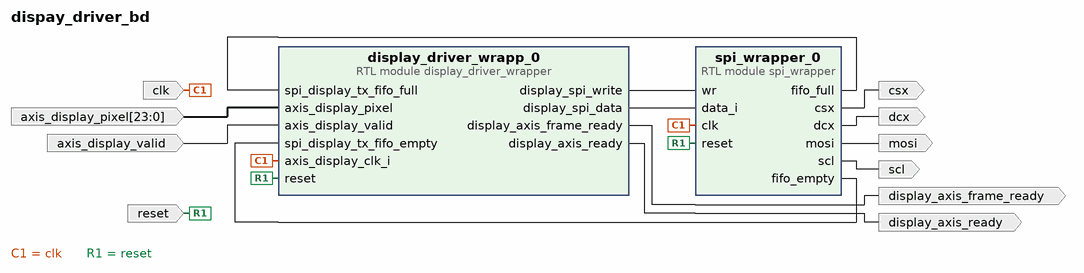
[diagram p0: block diagram of the top level]
# Vivado block design dispay_driver_bd, xc7z010clg400-1, Vivado 2020.1
create_bd_design dispay_driver_bd

create_bd_port -dir I -type clk clk
set_property -dict {CONFIG.FREQ_HZ 100000000} [get_bd_ports clk]
create_bd_port -dir O mosi
create_bd_port -dir O scl
create_bd_port -dir O csx
create_bd_port -dir O dcx
create_bd_port -dir I -type rst reset
create_bd_port -dir I -from 23 -to 0 axis_display_pixel
create_bd_port -dir I axis_display_valid
create_bd_port -dir O display_axis_ready
create_bd_port -dir O display_axis_frame_ready

create_bd_cell -type module -reference spi_wrapper spi_wrapper_0
create_bd_cell -type module -reference display_driver_wrapper display_driver_wrapp_0

# ---- connections ----

connect_bd_net [get_bd_pins display_driver_wrapp_0/display_spi_write] [get_bd_pins spi_wrapper_0/wr]
connect_bd_net [get_bd_pins display_driver_wrapp_0/display_spi_data] [get_bd_pins spi_wrapper_0/data_i]
connect_bd_net [get_bd_pins spi_wrapper_0/fifo_full] [get_bd_pins display_driver_wrapp_0/spi_display_tx_fifo_full]
connect_bd_net [get_bd_pins spi_wrapper_0/fifo_empty] [get_bd_pins display_driver_wrapp_0/spi_display_tx_fifo_empty]
connect_bd_net [get_bd_ports clk] [get_bd_pins spi_wrapper_0/clk] [get_bd_pins display_driver_wrapp_0/axis_display_clk_i]
connect_bd_net [get_bd_pins spi_wrapper_0/mosi] [get_bd_ports mosi]
connect_bd_net [get_bd_pins spi_wrapper_0/scl] [get_bd_ports scl]
connect_bd_net [get_bd_pins spi_wrapper_0/csx] [get_bd_ports csx]
connect_bd_net [get_bd_pins spi_wrapper_0/dcx] [get_bd_ports dcx]
connect_bd_net -net reset_0_1 [get_bd_ports reset] [get_bd_pins spi_wrapper_0/reset] [get_bd_pins display_driver_wrapp_0/reset]
connect_bd_net -net axis_display_pixel_0_1 [get_bd_ports axis_display_pixel] [get_bd_pins display_driver_wrapp_0/axis_display_pixel]
connect_bd_net -net axis_display_valid_0_1 [get_bd_ports axis_display_valid] [get_bd_pins display_driver_wrapp_0/axis_display_valid]
connect_bd_net [get_bd_pins display_driver_wrapp_0/display_axis_ready] [get_bd_ports display_axis_ready]
connect_bd_net [get_bd_pins display_driver_wrapp_0/display_axis_frame_ready] [get_bd_ports display_axis_frame_ready]

validate_bd_design
save_bd_design
